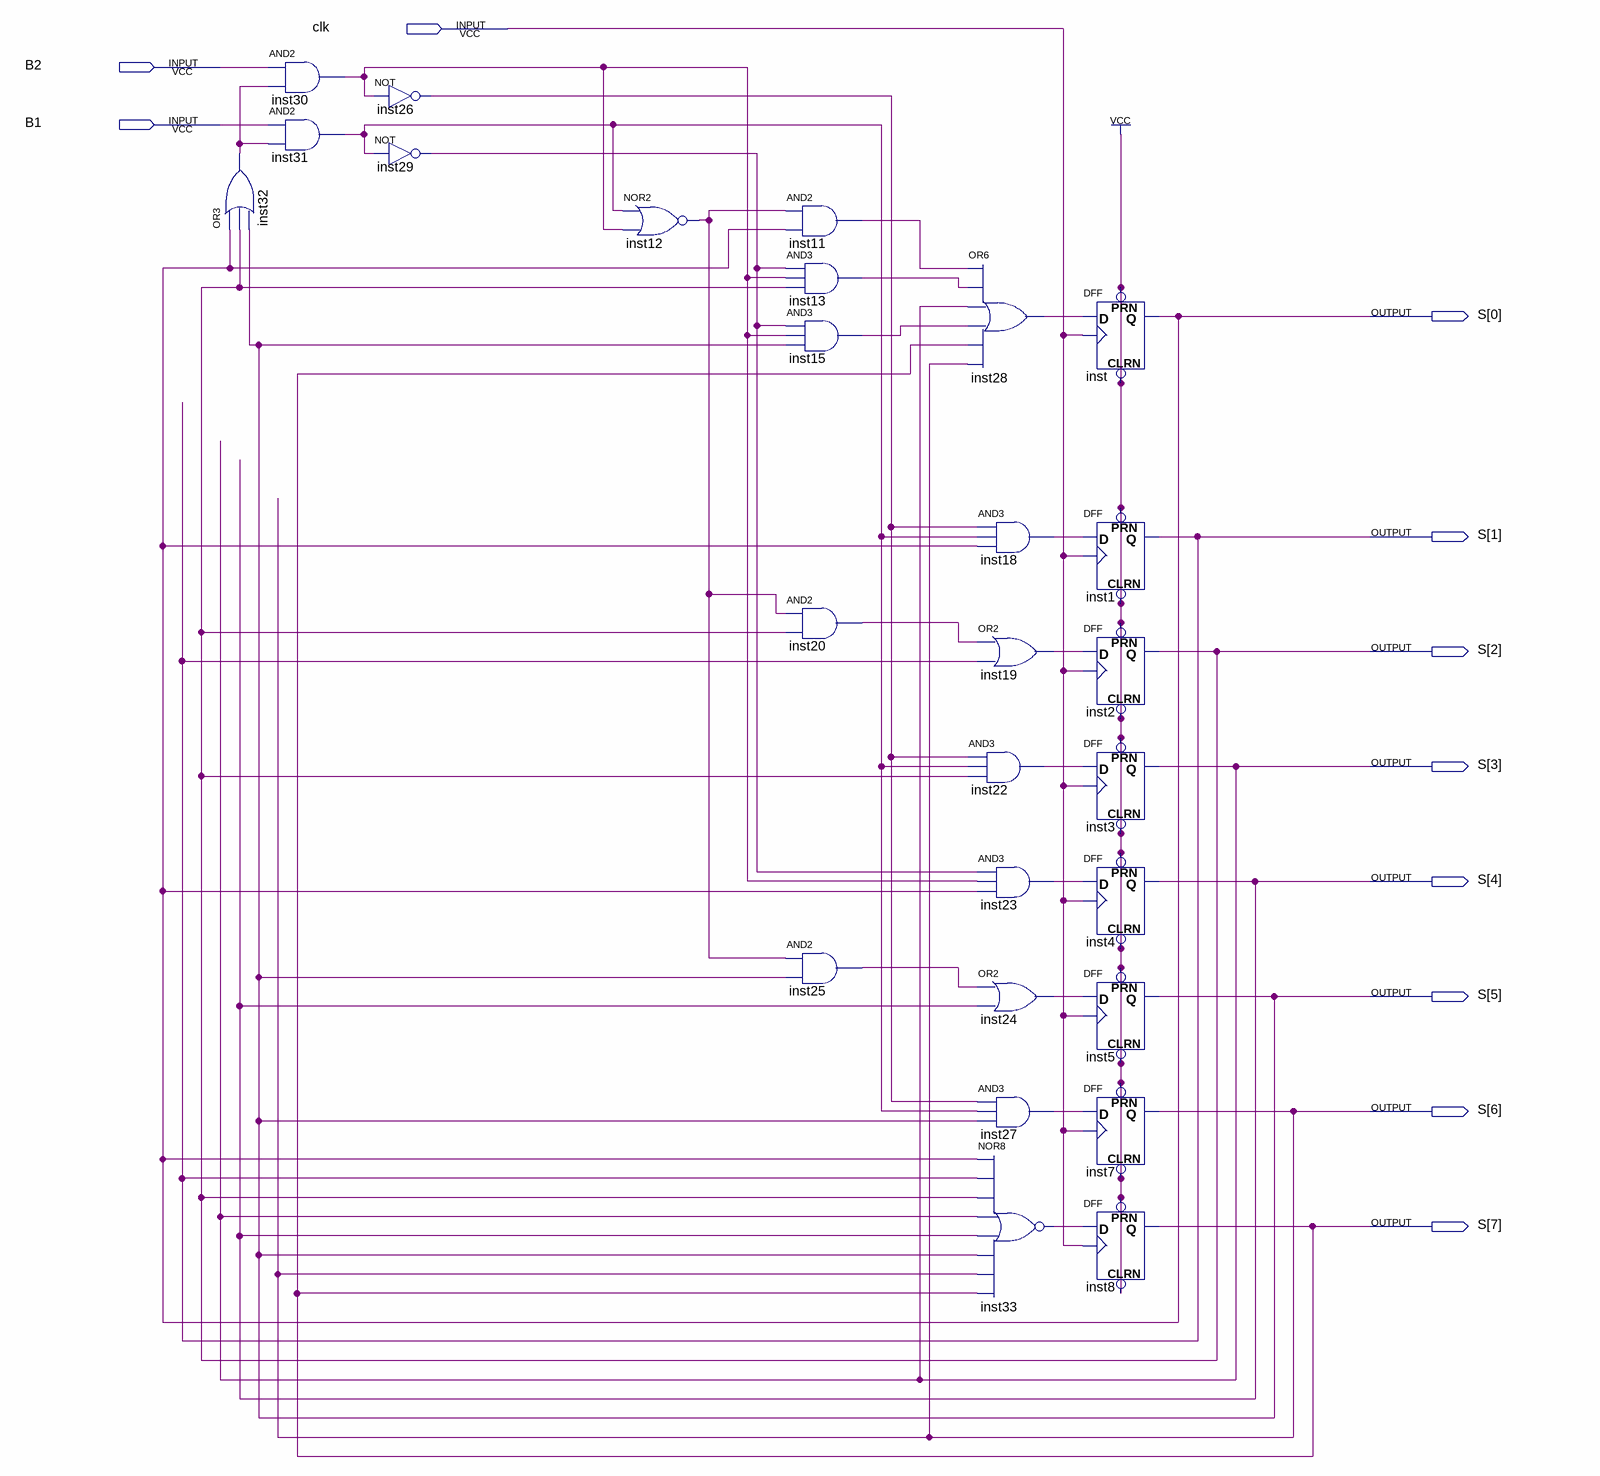
[diagram p0: schematic sheet]
// Quartus schematic mainFSM.bdf as structural Verilog: 27 symbols, 11 pins
module mainFSM (
  input  clk,
  input  B2,
  input  B1,
  output [7:0] S
);

  wire inst11_out, inst12_out, inst13_out, inst15_out, inst18_out, inst19_out, inst20_out, inst22_out,
       inst23_out, inst24_out, inst25_out, inst26_out, inst27_out, inst28_out, inst29_out, inst30_out,
       inst31_out, inst32_out, inst33_out;

  or inst32 (inst32_out, S[0], S[2], S[5]);
  and inst30 (inst30_out, B2, inst32_out);
  and inst31 (inst31_out, B1, inst32_out);
  not inst26 (inst26_out, inst30_out);
  not inst29 (inst29_out, inst31_out);
  nor inst12 (inst12_out, inst31_out, inst30_out);
  and inst11 (inst11_out, inst12_out, S[0]);
  and inst13 (inst13_out, inst29_out, inst30_out, S[2]);
  and inst15 (inst15_out, inst29_out, inst30_out, S[5]);
  and inst20 (inst20_out, inst12_out, S[2]);
  and inst25 (inst25_out, inst12_out, S[5]);
  or inst28 (inst28_out, inst11_out, inst13_out, S[3], inst15_out, S[7], S[6]);
  and inst18 (inst18_out, inst26_out, inst31_out, S[0]);
  or inst19 (inst19_out, inst20_out, S[1]);
  and inst22 (inst22_out, inst26_out, inst31_out, S[2]);
  and inst23 (inst23_out, inst29_out, inst30_out, S[0]);
  or inst24 (inst24_out, inst25_out, S[4]);
  and inst27 (inst27_out, inst26_out, inst31_out, S[5]);
  nor inst33 (inst33_out, S[0], S[1], S[2], S[3], S[4], S[5], S[6], S[7]);
  DFF inst (.CLRN(1'b1), .CLK(clk), .D(inst28_out), .PRN(1'b1), .Q(S[0]));
  DFF inst1 (.CLRN(1'b1), .CLK(clk), .D(inst18_out), .PRN(1'b1), .Q(S[1]));
  DFF inst2 (.CLRN(1'b1), .CLK(clk), .D(inst19_out), .PRN(1'b1), .Q(S[2]));
  DFF inst3 (.CLRN(1'b1), .CLK(clk), .D(inst22_out), .PRN(1'b1), .Q(S[3]));
  DFF inst4 (.CLRN(1'b1), .CLK(clk), .D(inst23_out), .PRN(1'b1), .Q(S[4]));
  DFF inst5 (.CLRN(1'b1), .CLK(clk), .D(inst24_out), .PRN(1'b1), .Q(S[5]));
  DFF inst7 (.CLRN(1'b1), .CLK(clk), .D(inst27_out), .PRN(1'b1), .Q(S[6]));
  DFF inst8 (.CLRN(1'b1), .CLK(clk), .D(inst33_out), .PRN(1'b1), .Q(S[7]));
endmodule
